# EAGLE schematic MultiSpork-v1 (EAGLE 6.5.0)

## Sheet 1 of 6
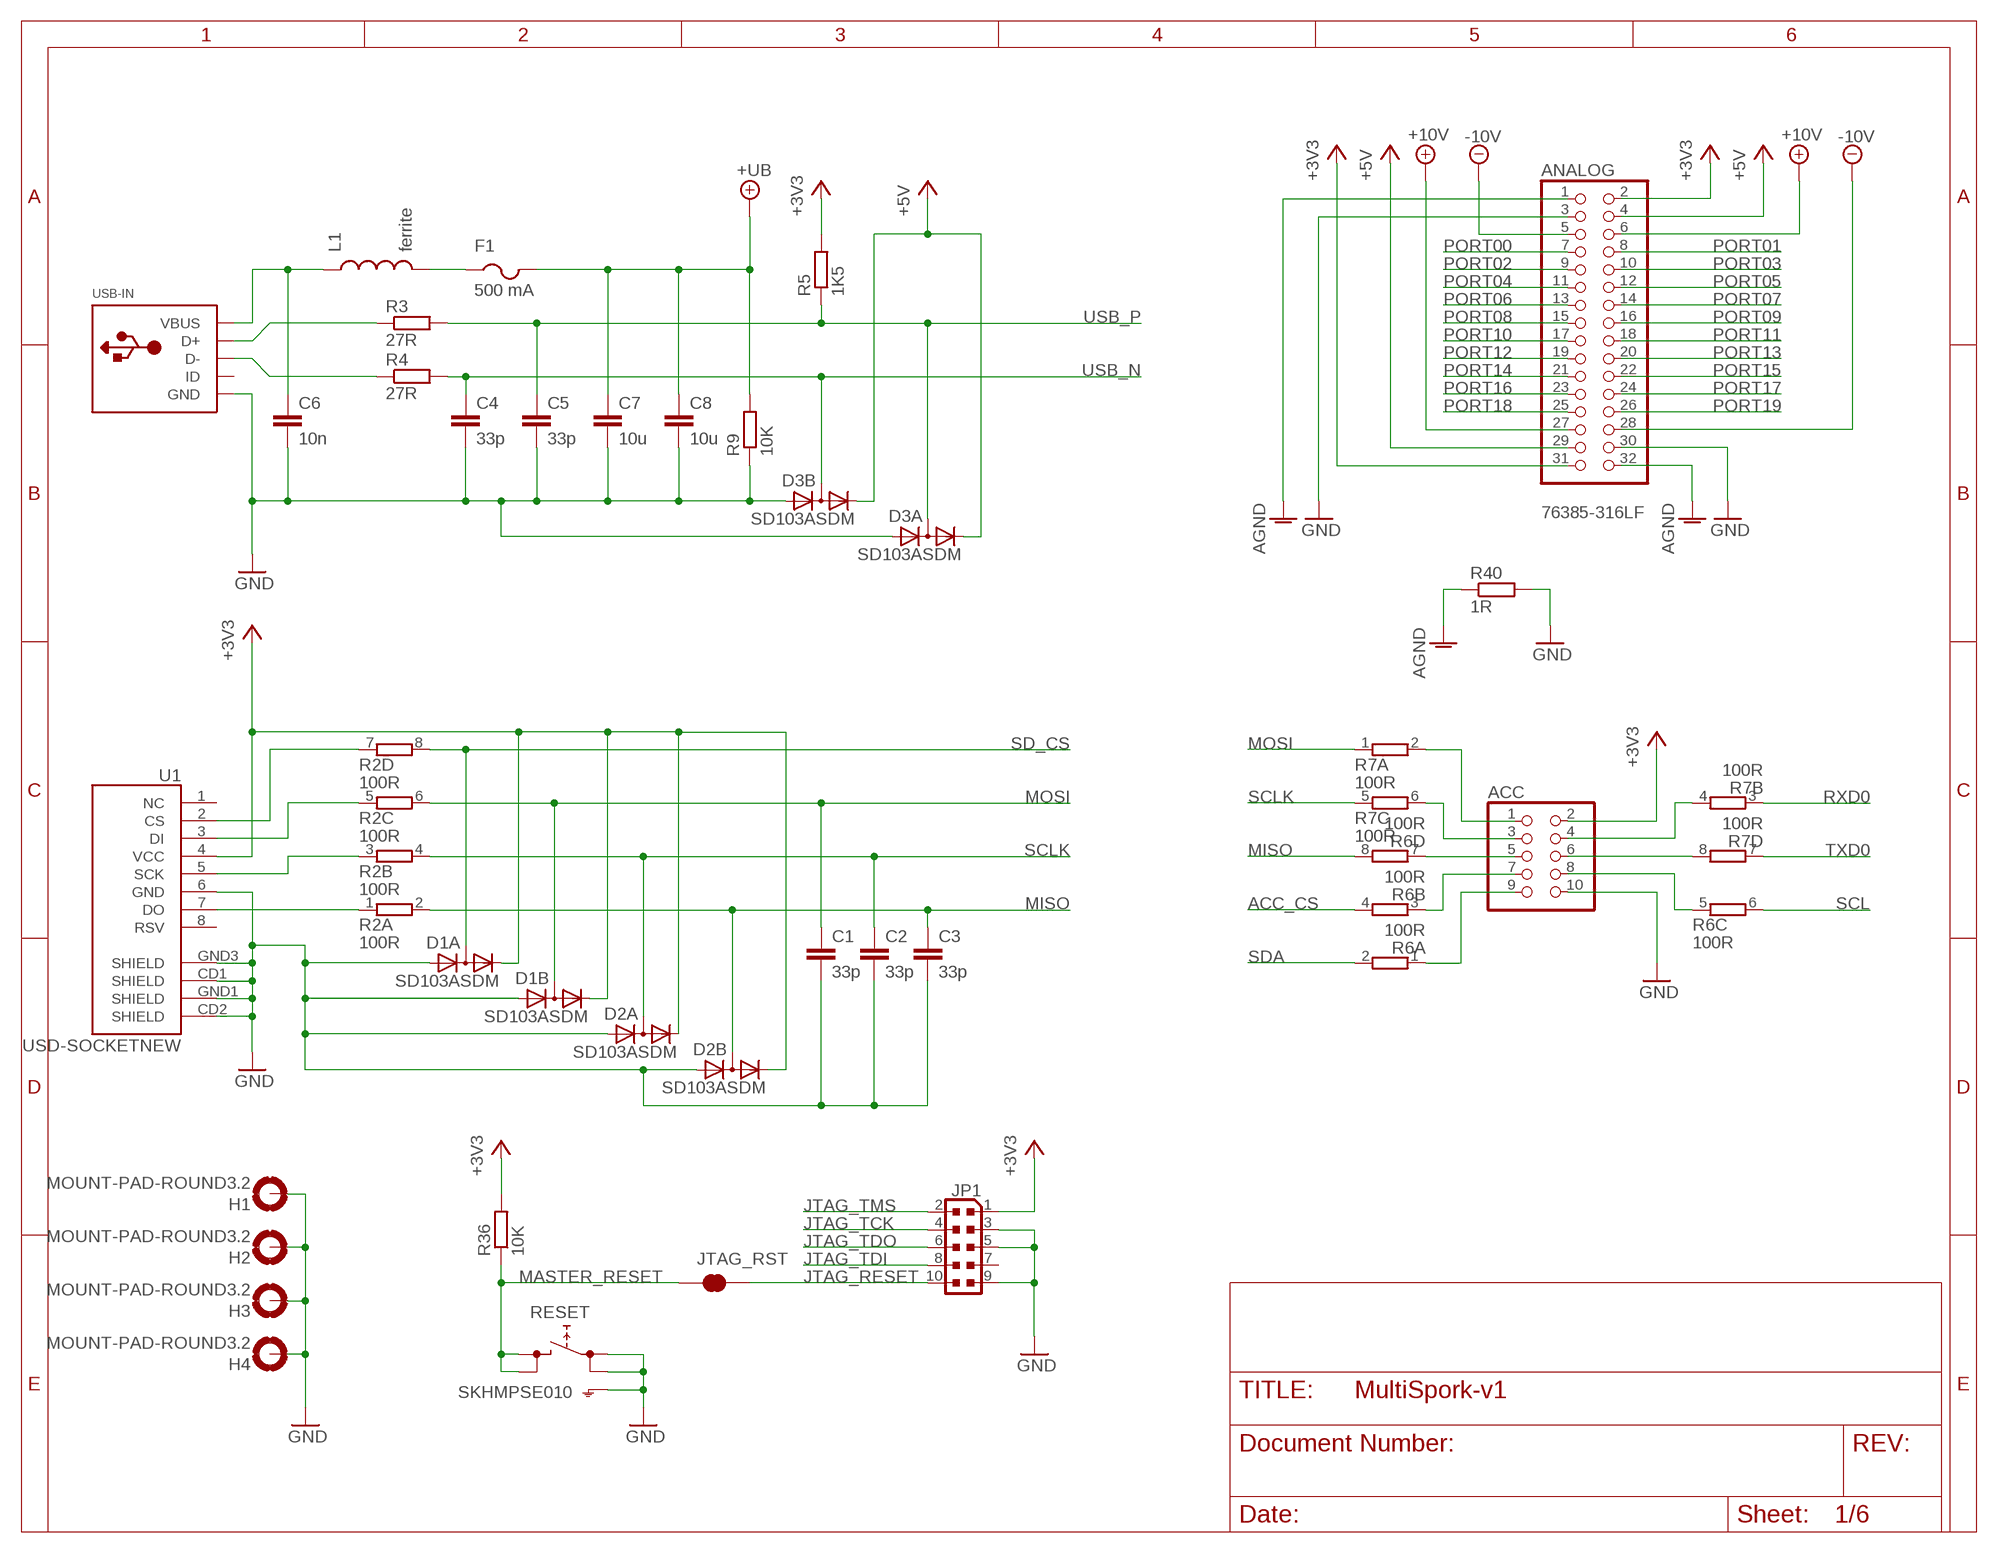
[diagram p0: schematic, sheet 1]

### Parts
ACC  PINHD-2X5_2.54  [2X05]
ANALOG  76385-316LF  [32P-SIDE-SMD]
C1  33p  C-EUC0603  [C0603]
C2  33p  C-EUC0603  [C0603]
C3  33p  C-EUC0603  [C0603]
C4  33p  C-EUC0603  [C0603]
C5  33p  C-EUC0603  [C0603]
C6  10n  C-EUC0603  [C0603]
C7  10u  C-EUC1206  [C1206]
C8  10u  C-EUC1206  [C1206]
D1  SD103ASDM  [SOT26]
D2  SD103ASDM  [SOT26]
D3  SD103ASDM  [SOT26]
F1  500 mA  PTCFUSE-1206  [R1206]
H1  MOUNT-PAD-ROUND3.2  [3,2-PAD]
H2  MOUNT-PAD-ROUND3.2  [3,2-PAD]
H3  MOUNT-PAD-ROUND3.2  [3,2-PAD]
H4  MOUNT-PAD-ROUND3.2  [3,2-PAD]
JP1  PINHEAD_PINHD-2X5PASSO127  [PINHEAD_2X05_127]
JTAG_RST  JUMPER-PAD-2-NC_BY_TRACE  [PAD-JUMPER-2-NC_BY_TRACE_YES_SILK]
L1  ferrite  INDUCTOR0805  [0805]
R2  100R  4R-NCTS742C083  [CTS742C083-RES]
R3  27R  R-EU_R0603  [R0603]
R4  27R  R-EU_R0603  [R0603]
R5  1K5  R-EU_R0603  [R0603]
R6  100R  4R-NCTS742C083  [CTS742C083-RES]
R7  100R  4R-NCTS742C083  [CTS742C083-RES]
R9  10K  R-EU_R0603  [R0603]
R36  10K  R-EU_R0603  [R0603]
R40  1R  R-EU_R1206  [R1206]
RESET  SKHMPSE010  [SKHMPXE010]
U1  USD-SOCKETNEW  [MICRO-SD-SOCKET-PP]
USB-IN  USBMINIB  [USB-MINIB]

### Nets
+3V3: ACC.2 ANALOG.2 ANALOG.31 D1.2(A:C) D1.5(B:C) D2.2(A:C) D2.5(B:C) JP1.1 R5.2 R36.2 U1.4(VCC) ; also sheet 2,3,5,6
+5V: ANALOG.4 ANALOG.29 D3.2(A:C) D3.5(B:C) ; also sheet 3,5
+10V: ANALOG.6 ANALOG.27 ; also sheet 3,4,5
+UB: C7.1 C8.1 F1.2 R9.2 ; also sheet 3
-10V: ANALOG.5 ANALOG.28 ; also sheet 3,4,5
ACC_CS: R6.4 ; also sheet 2
AGND: ANALOG.1 ANALOG.32 R40.1 ; also sheet 5
GND: ACC.10 ANALOG.3 ANALOG.30 C1.2 C2.2 C3.2 C4.2 C5.2 C6.2 C7.2 C8.2 D1.3(A:A) D1.6(B:A) D2.3(A:A) D2.6(B:A) D3.3(A:A) D3.6(B:A) H1.B3,2(MOUNT) H2.B3,2(MOUNT) H3.B3,2(MOUNT) H4.B3,2(MOUNT) JP1.3 JP1.5 JP1.9 R9.1 R40.2 RESET.1(1.1) RESET.2(1.2) RESET.5(SH) U1.6(GND) U1.CD1(SHIELD) U1.CD2(SHIELD) U1.GND1(SHIELD) U1.GND3(SHIELD) USB-IN.GND ; also sheet 2,3,5,6
JTAG_RESET: JP1.10 JTAG_RST.2
JTAG_TCK: JP1.4 ; also sheet 2
JTAG_TDI: JP1.8 ; also sheet 2
JTAG_TDO: JP1.6 ; also sheet 2
JTAG_TMS: JP1.2 ; also sheet 2
MASTER_RESET: JTAG_RST.1 R36.1 RESET.3(2.1) RESET.4(2.2) ; also sheet 2
MISO: C3.1 D2.1(B:AC) R2.2 R6.8 ; also sheet 2
MOSI: C1.1 D1.1(B:AC) R2.6 R7.1 ; also sheet 2
N$1: C6.1 L1.1 USB-IN.VBUS
N$2: R2.7 U1.2(CS)
N$4: R2.5 U1.3(DI)
N$5: R2.3 U1.5(SCK)
N$6: R2.1 U1.7(DO)
N$7: R3.1 USB-IN.D+
N$8: R4.1 USB-IN.D-
N$9: ACC.1 R7.2
N$10: ACC.3 R7.6
N$11: ACC.5 R6.7
N$12: ACC.7 R6.3
N$13: ACC.9 R6.1
N$14: ACC.6 R7.8
N$15: ACC.4 R7.4
N$16: ACC.8 R6.5
N$17: F1.1 L1.2
PORT00: ANALOG.7 ; also sheet 4
PORT01: ANALOG.8 ; also sheet 4
PORT02: ANALOG.9 ; also sheet 4
PORT03: ANALOG.10 ; also sheet 4
PORT04: ANALOG.11 ; also sheet 4
PORT05: ANALOG.12 ; also sheet 4
PORT06: ANALOG.13 ; also sheet 4
PORT07: ANALOG.14 ; also sheet 4
PORT08: ANALOG.15 ; also sheet 4
PORT09: ANALOG.16 ; also sheet 4
PORT10: ANALOG.17 ; also sheet 4
PORT11: ANALOG.18 ; also sheet 4
PORT12: ANALOG.19 ; also sheet 4
PORT13: ANALOG.20 ; also sheet 4
PORT14: ANALOG.21 ; also sheet 4
PORT15: ANALOG.22 ; also sheet 4
PORT16: ANALOG.23 ; also sheet 4
PORT17: ANALOG.24 ; also sheet 4
PORT18: ANALOG.25 ; also sheet 4
PORT19: ANALOG.26 ; also sheet 4
RXD0: R7.3 ; also sheet 2
SCL: R6.6 ; also sheet 2
SCLK: C2.1 D2.4(A:AC) R2.4 R7.5 ; also sheet 2
SD_CS: D1.4(A:AC) R2.8 ; also sheet 2
SDA: R6.2 ; also sheet 2
TXD0: R7.7 ; also sheet 2
USB_N: C4.1 D3.1(B:AC) R4.2 ; also sheet 2
USB_P: C5.1 D3.4(A:AC) R3.2 R5.1 ; also sheet 2
Unconnected: JP1.7 U1.1(NC) U1.8(RSV) USB-IN.ID

## Sheet 2 of 6
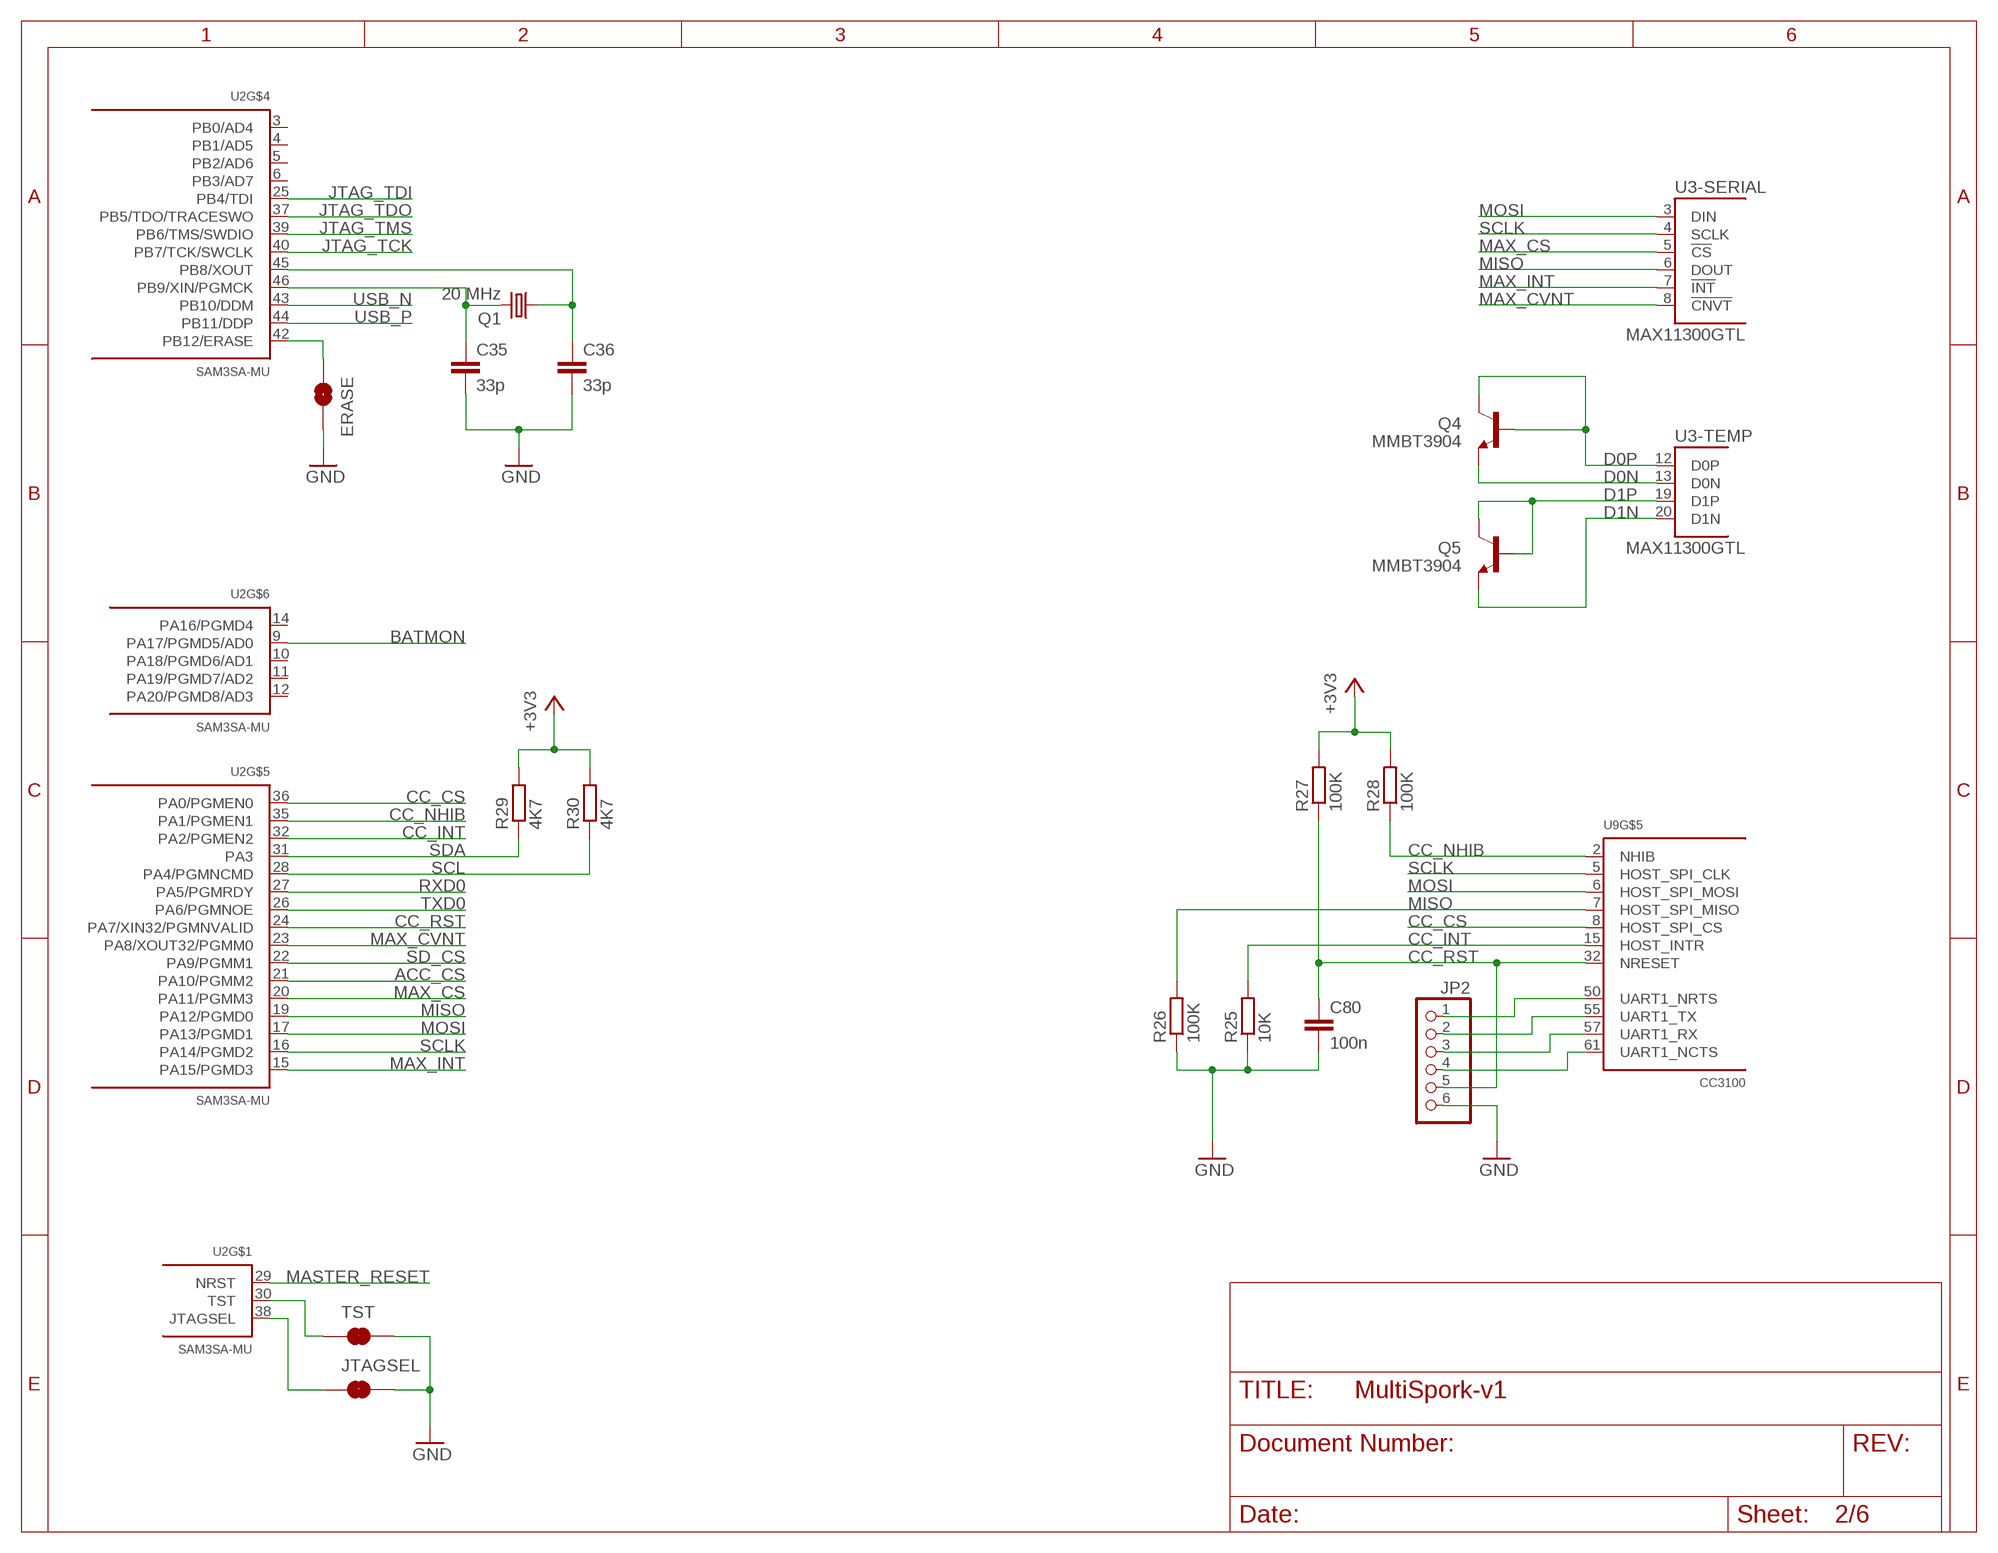
[diagram p1: schematic, sheet 2]

### Parts
C35  33p  C-EUC0603  [C0603]
C36  33p  C-EUC0603  [C0603]
C80  100n  C-EUC0603  [C0603]
ERASE  JUMPER-PAD-2-NOYES_SILK  [PAD-JUMPER-2-NO_YES_SILK]
JP2  PINHD-1X6  [1X06]
JTAGSEL  JUMPER-PAD-2-NC_BY_TRACE  [PAD-JUMPER-2-NC_BY_TRACE_YES_SILK]
Q1  20 MHz  CRYSTALCSM-3X  [CSM-3X]
Q4  MMBT3904  TRANSISTOR_NPNMMBT5088  [SOT23]
Q5  MMBT3904  TRANSISTOR_NPNMMBT5088  [SOT23]
R25  10K  R-EU_R0603  [R0603]
R26  100K  R-EU_R0603  [R0603]
R27  100K  R-EU_R0603  [R0603]
R28  100K  R-EU_R0603  [R0603]
R29  4K7  R-EU_R0603  [R0603]
R30  4K7  R-EU_R0603  [R0603]
TST  JUMPER-PAD-2-NC_BY_TRACE  [PAD-JUMPER-2-NC_BY_TRACE_YES_SILK]
U2  SAM3SA-MU  [QFN48]
U3  MAX11300GTL  [TQFN40]
U9  CC3100  [QFN64]

### Nets
+3V3: R27.2 R28.2 R29.2 R30.2 ; also sheet 1,3,5,6
ACC_CS: U2.21(PA10/PGMM2) ; also sheet 1
BATMON: U2.9(PA17/PGMD5/AD0) ; also sheet 3
CC_CS: U2.36(PA0/PGMEN0) U9.8(HOST_SPI_CS)
CC_INT: R25.2 U2.32(PA2/PGMEN2) U9.15(HOST_INTR)
CC_NHIB: R28.1 U2.35(PA1/PGMEN1) U9.2(NHIB)
CC_RST: C80.1 JP2.5 R27.1 U2.24(PA7/XIN32/PGMNVALID) U9.32(NRESET)
D0N: Q4.2(E) U3.13(-TEMP:D0N)
D0P: Q4.1(B) Q4.3(C) U3.12(-TEMP:D0P)
D1N: Q5.2(E) U3.20(-TEMP:D1N)
D1P: Q5.1(B) Q5.3(C) U3.19(-TEMP:D1P)
GND: C35.2 C36.2 C80.2 ERASE.2 JP2.6 JTAGSEL.2 R25.1 R26.1 TST.2 ; also sheet 1,3,5,6
JTAG_TCK: U2.40(PB7/TCK/SWCLK) ; also sheet 1
JTAG_TDI: U2.25(PB4/TDI) ; also sheet 1
JTAG_TDO: U2.37(PB5/TDO/TRACESWO) ; also sheet 1
JTAG_TMS: U2.39(PB6/TMS/SWDIO) ; also sheet 1
MASTER_RESET: U2.29(NRST) ; also sheet 1
MAX_CS: U2.20(PA11/PGMM3) U3.5(-SERIAL:!CS!)
MAX_CVNT: U2.23(PA8/XOUT32/PGMM0) U3.8(-SERIAL:!CNVT!)
MAX_INT: U2.15(PA15/PGMD3) U3.7(-SERIAL:!INT!)
MISO: R26.2 U2.19(PA12/PGMD0) U3.6(-SERIAL:DOUT) U9.7(HOST_SPI_MISO) ; also sheet 1
MOSI: U2.17(PA13/PGMD1) U3.3(-SERIAL:DIN) U9.6(HOST_SPI_MOSI) ; also sheet 1
N$3: C35.1 Q1.2 U2.46(PB9/XIN/PGMCK)
N$27: C36.1 Q1.1 U2.45(PB8/XOUT)
N$29: TST.1 U2.30(TST)
N$30: JTAGSEL.1 U2.38(JTAGSEL)
N$31: ERASE.1 U2.42(PB12/ERASE)
N$106: JP2.1 U9.50(UART1_NRTS)
N$107: JP2.2 U9.55(UART1_TX)
N$108: JP2.3 U9.57(UART1_RX)
N$109: JP2.4 U9.61(UART1_NCTS)
RXD0: U2.27(PA5/PGMRDY) ; also sheet 1
SCL: R30.1 U2.28(PA4/PGMNCMD) ; also sheet 1
SCLK: U2.16(PA14/PGMD2) U3.4(-SERIAL:SCLK) U9.5(HOST_SPI_CLK) ; also sheet 1
SD_CS: U2.22(PA9/PGMM1) ; also sheet 1
SDA: R29.1 U2.31(PA3) ; also sheet 1
TXD0: U2.26(PA6/PGMNOE) ; also sheet 1
USB_N: U2.43(PB10/DDM) ; also sheet 1
USB_P: U2.44(PB11/DDP) ; also sheet 1
Unconnected: U2.3(PB0/AD4) U2.4(PB1/AD5) U2.5(PB2/AD6) U2.6(PB3/AD7) U2.10(PA18/PGMD6/AD1) U2.11(PA19/PGMD7/AD2) U2.12(PA20/PGMD8/AD3) U2.14(PA16/PGMD4)

## Sheet 3 of 6
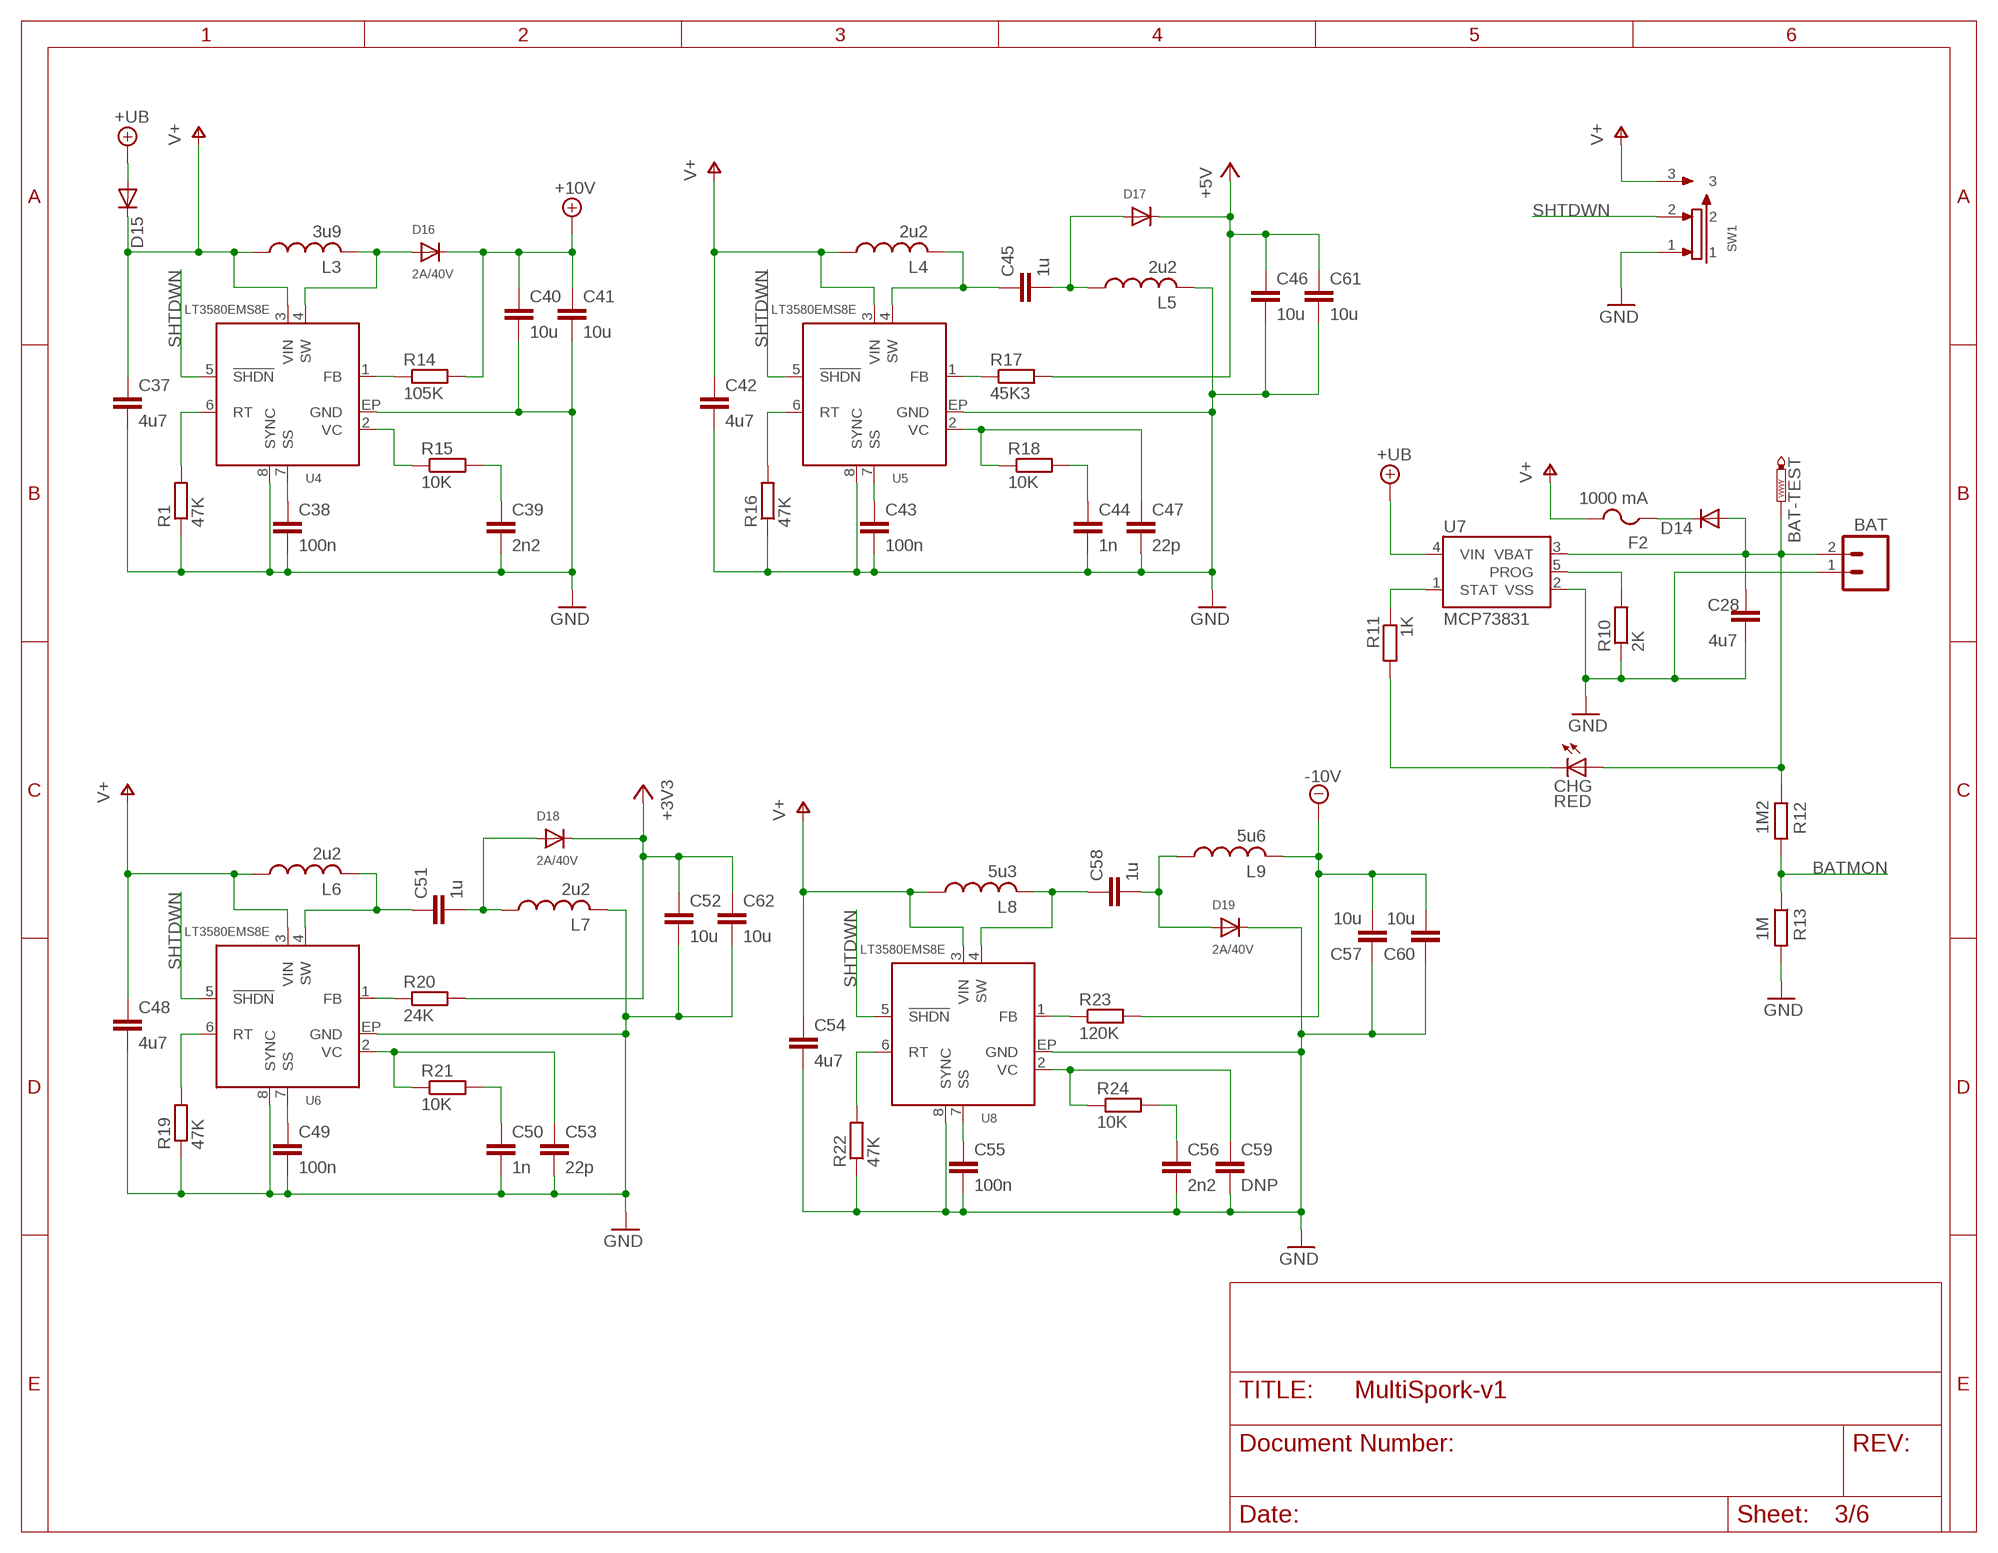
[diagram p2: schematic, sheet 3]

### Parts
BAT  M02-JST-2MM-SMT  [S2B-PH]
BAT-TEST  PTR1TP13SQ  [TP13SQ]
C28  4u7  C-EUC1206  [C1206]
C37  4u7  C-EUC1210  [C1210]
C38  100n  C-EUC0603  [C0603]
C39  2n2  C-EUC0603  [C0603]
C40  10u  C-EUC1210  [C1210]
C41  10u  C-EUC1210  [C1210]
C42  4u7  C-EUC1210  [C1210]
C43  100n  C-EUC0603  [C0603]
C44  1n  C-EUC0603  [C0603]
C45  1u  C-EUC1210  [C1210]
C46  10u  C-EUC1210  [C1210]
C47  22p  C-EUC0603  [C0603]
C48  4u7  C-EUC1210  [C1210]
C49  100n  C-EUC0603  [C0603]
C50  1n  C-EUC0603  [C0603]
C51  1u  C-EUC1210  [C1210]
C52  10u  C-EUC1210  [C1210]
C53  22p  C-EUC0603  [C0603]
C54  4u7  C-EUC1210  [C1210]
C55  100n  C-EUC0603  [C0603]
C56  2n2  C-EUC0603  [C0603]
C57  10u  C-EUC1210  [C1210]
C58  1u  C-EUC1210  [C1210]
C59  DNP  C-EUC0603  [C0603]
C60  10u  C-EUC1210  [C1210]
C61  10u  C-EUC1210  [C1210]
C62  10u  C-EUC1210  [C1210]
CHG  RED  LEDCHIP-LED0603  [CHIP-LED0603]
D14  DIODE-SMB  [SMB]
D15  DIODE-SMB  [SMB]
D16  2A/40V  DIODESMA  [SMADIODE]
D17  DIODESOD-123  [SOD-123]
D18  2A/40V  DIODESMA  [SMADIODE]
D19  2A/40V  DIODESMA  [SMADIODE]
F2  1000 mA  PTCFUSE-1206  [R1206]
L3  3u9  L-US2323  [L2323]
L4  2u2  L-US1008  [L1008]
L5  2u2  L-US1008  [L1008]
L6  2u2  L-US1008  [L1008]
L7  2u2  L-US1008  [L1008]
L8  5u3  L-US2323  [L2323]
L9  5u6  L-US1008  [L1008]
R1  47K  R-EU_R0603  [R0603]
R10  2K  R-EU_R0603  [R0603]
R11  1K  R-EU_R0603  [R0603]
R12  1M2  R-EU_R0603  [R0603]
R13  1M  R-EU_R0603  [R0603]
R14  105K  R-EU_R0603  [R0603]
R15  10K  R-EU_R0603  [R0603]
R16  47K  R-EU_R0603  [R0603]
R17  45K3  R-EU_R0603  [R0603]
R18  10K  R-EU_R0603  [R0603]
R19  47K  R-EU_R0603  [R0603]
R20  24K  R-EU_R0603  [R0603]
R21  10K  R-EU_R0603  [R0603]
R22  47K  R-EU_R0603  [R0603]
R23  120K  R-EU_R0603  [R0603]
R24  10K  R-EU_R0603  [R0603]
SW1  JS102011SAQN  [JS102011SAQN]
U4  LT3580EMS8E  [MSOP8]
U5  LT3580EMS8E  [MSOP8]
U6  LT3580EMS8E  [MSOP8]
U7  MCP73831  [SOT23-5]
U8  LT3580EMS8E  [MSOP8]

### Nets
+3V3: C52.1 C62.1 D18.C R20.2 ; also sheet 1,2,5,6
+5V: C46.1 C61.1 D17.C R17.2 ; also sheet 1,5
+10V: C40.1 C41.1 D16.C R14.2 ; also sheet 1,4,5
+UB: D15.A U7.4(VIN) ; also sheet 1
-10V: C57.2 C60.2 L9.2 R23.2 ; also sheet 1,4,5
BATMON: R12.2 R13.1 ; also sheet 2
GND: BAT.1 C28.2 C37.2 C38.2 C39.2 C40.2 C41.2 C42.2 C43.2 C44.2 C46.2 C47.2 C48.2 C49.2 C50.2 C52.2 C53.2 C54.2 C55.2 C56.2 C57.1 C59.2 C60.1 C61.2 C62.2 D19.C L5.2 L7.2 R1.1 R10.1 R13.2 R16.1 R19.1 R22.1 SW1.1 U4.8(SYNC) U4.EP(GND) U5.8(SYNC) U5.EP(GND) U6.8(SYNC) U6.EP(GND) U7.2(VSS) U8.8(SYNC) U8.EP(GND) ; also sheet 1,2,5,6
N$18: C38.1 U4.7(SS)
N$20: R1.2 U4.6(RT)
N$21: R14.1 U4.1(FB)
N$22: R15.1 U4.2(VC)
N$23: C39.1 R15.2
N$24: C43.1 U5.7(SS)
N$25: D16.A L3.4 U4.4(SW)
N$26: R16.2 U5.6(RT)
N$28: R17.1 U5.1(FB)
N$48: R10.2 U7.5(PROG)
N$55: R11.1 U7.1(STAT)
N$57: CHG.C R11.2
N$58: D14.C F2.1
N$60: C47.1 R18.1 U5.2(VC)
N$61: C44.1 R18.2
N$63: C45.1 L4.2 U5.4(SW)
N$64: C45.2 D17.A L5.1
N$65: C55.1 U8.7(SS)
N$66: R22.2 U8.6(RT)
N$67: R23.1 U8.1(FB)
N$68: C49.1 U6.7(SS)
N$69: R19.2 U6.6(RT)
N$70: R20.1 U6.1(FB)
N$71: C53.1 R21.1 U6.2(VC)
N$72: C50.1 R21.2
N$73: C51.1 L6.2 U6.4(SW)
N$74: C51.2 D18.A L7.1
N$75: C59.1 R24.1 U8.2(VC)
N$76: C56.1 R24.2
N$77: C58.1 L8.4 U8.4(SW)
N$78: C58.2 D19.A L9.1
SHTDWN: SW1.2 U4.5(!SHDN!) U5.5(!SHDN!) U6.5(!SHDN!) U8.5(!SHDN!)
V+: C37.1 C42.1 C48.1 C54.1 D15.C F2.2 L3.3 L4.1 L6.1 L8.3 SW1.3 U4.3(VIN) U5.3(VIN) U6.3(VIN) U8.3(VIN)
VBAT1: BAT-TEST.TP BAT.2 C28.1 CHG.A D14.A R12.1 U7.3(VBAT)

## Sheet 4 of 6
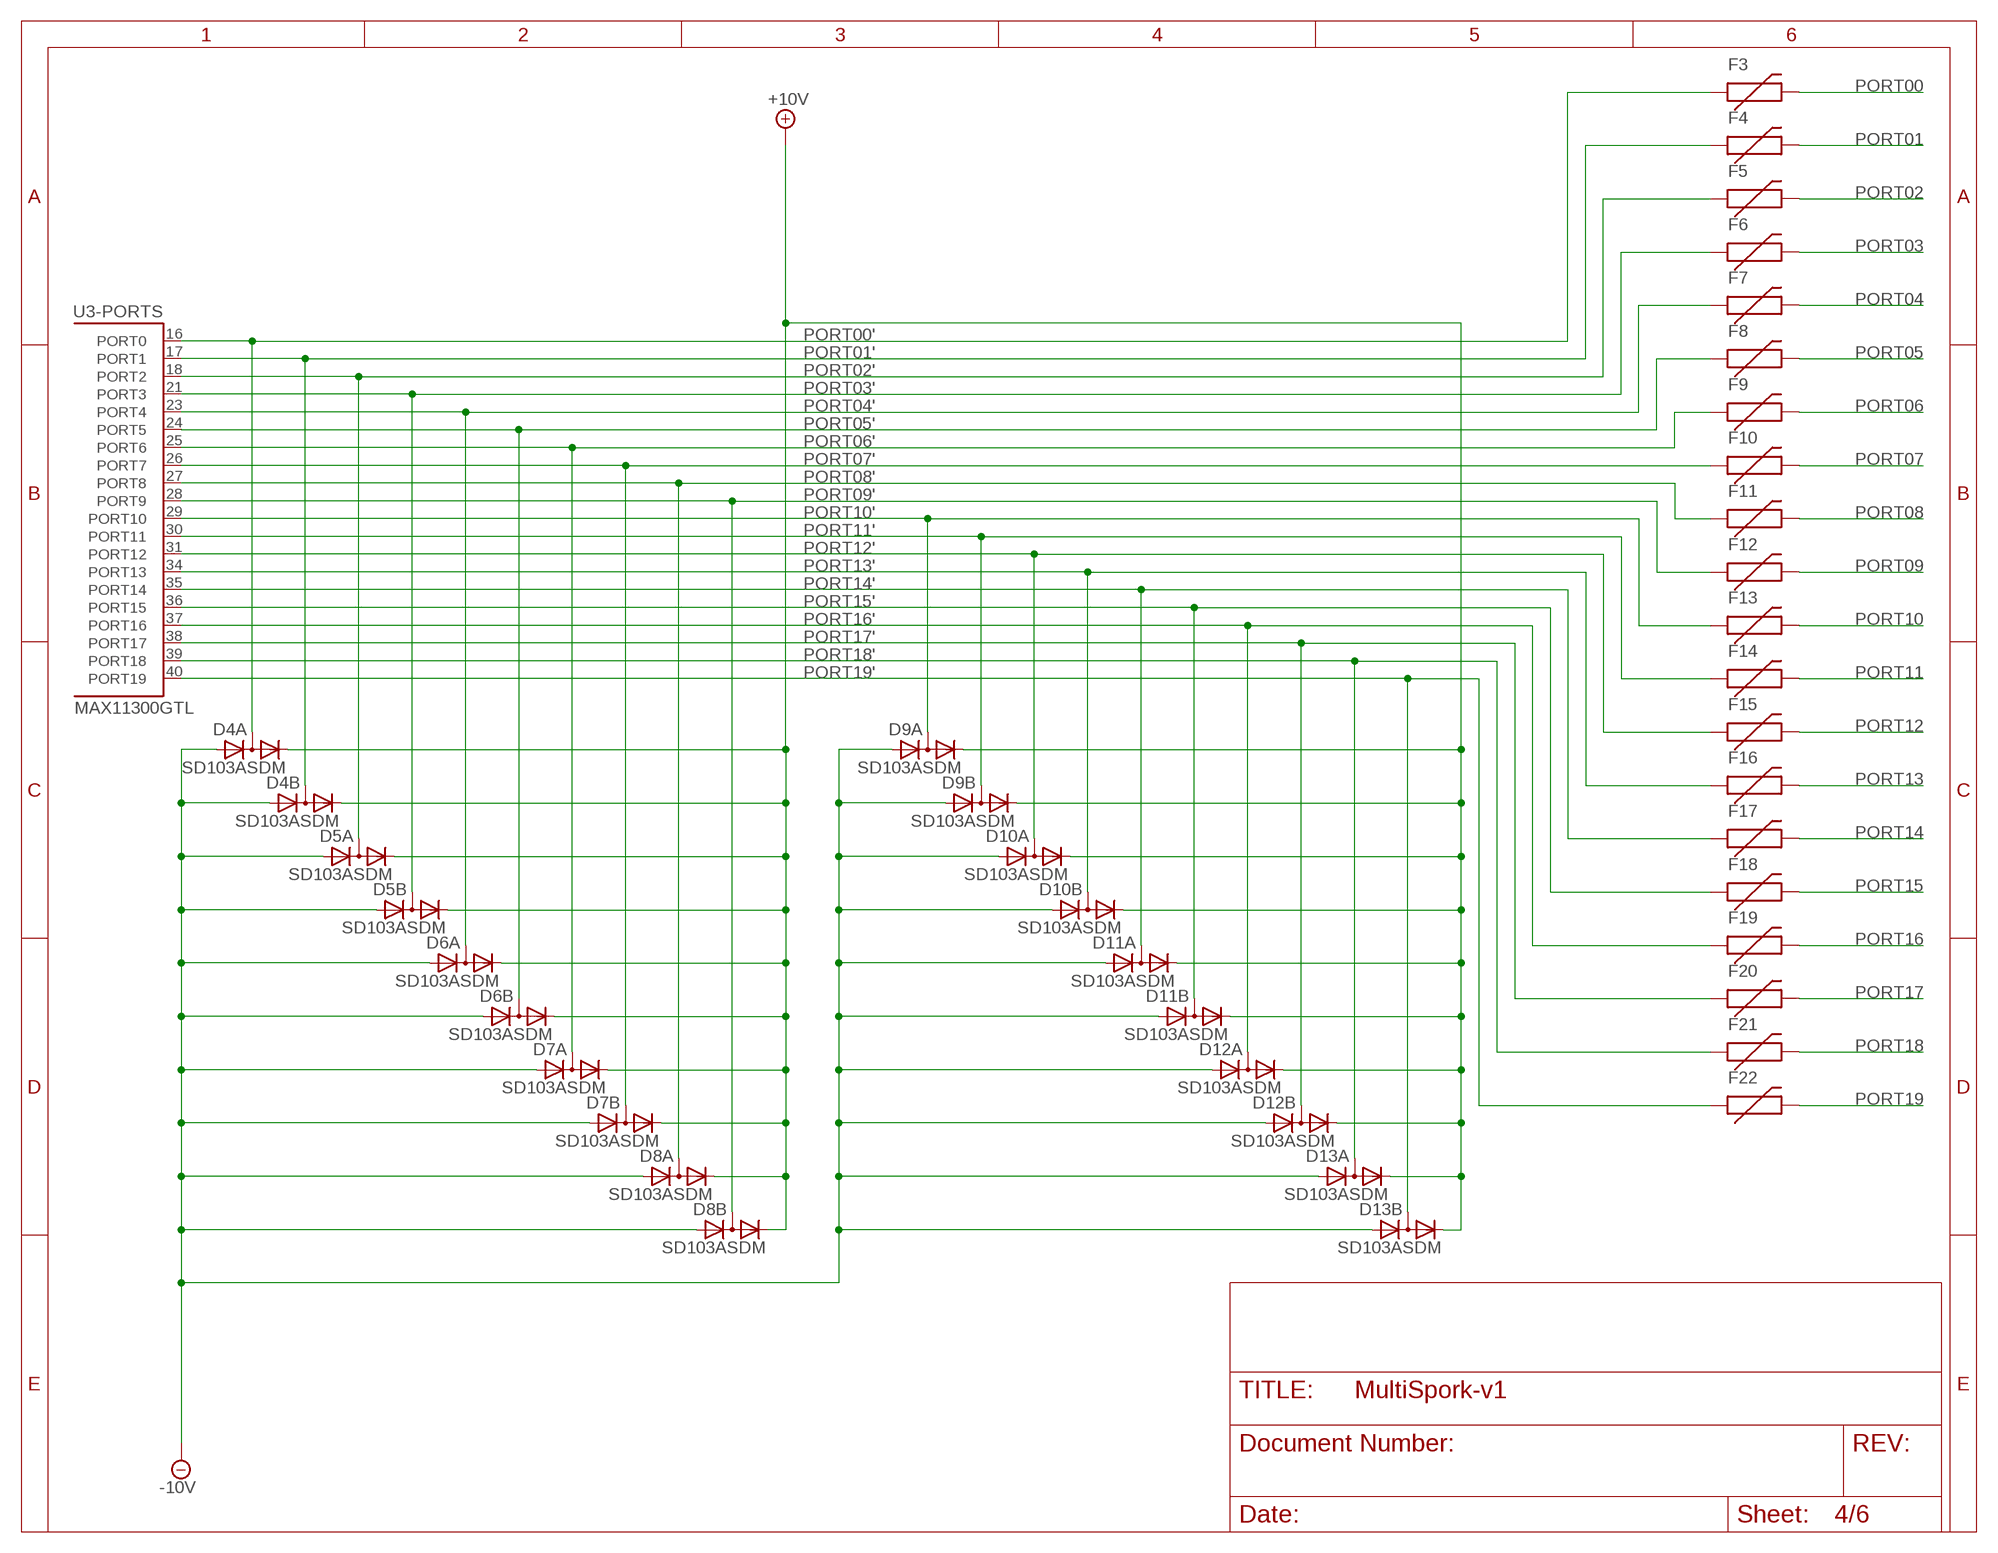
[diagram p3: schematic, sheet 4]

### Parts
D4  SD103ASDM  [SOT26]
D5  SD103ASDM  [SOT26]
D6  SD103ASDM  [SOT26]
D7  SD103ASDM  [SOT26]
D8  SD103ASDM  [SOT26]
D9  SD103ASDM  [SOT26]
D10  SD103ASDM  [SOT26]
D11  SD103ASDM  [SOT26]
D12  SD103ASDM  [SOT26]
D13  SD103ASDM  [SOT26]
F3  PTC0603  [0603]
F4  PTC0603  [0603]
F5  PTC0603  [0603]
F6  PTC0603  [0603]
F7  PTC0603  [0603]
F8  PTC0603  [0603]
F9  PTC0603  [0603]
F10  PTC0603  [0603]
F11  PTC0603  [0603]
F12  PTC0603  [0603]
F13  PTC0603  [0603]
F14  PTC0603  [0603]
F15  PTC0603  [0603]
F16  PTC0603  [0603]
F17  PTC0603  [0603]
F18  PTC0603  [0603]
F19  PTC0603  [0603]
F20  PTC0603  [0603]
F21  PTC0603  [0603]
F22  PTC0603  [0603]

### Nets
+10V: D4.2(A:C) D4.5(B:C) D5.2(A:C) D5.5(B:C) D6.2(A:C) D6.5(B:C) D7.2(A:C) D7.5(B:C) D8.2(A:C) D8.5(B:C) D9.2(A:C) D9.5(B:C) D10.2(A:C) D10.5(B:C) D11.2(A:C) D11.5(B:C) D12.2(A:C) D12.5(B:C) D13.2(A:C) D13.5(B:C) ; also sheet 1,3,5
-10V: D4.3(A:A) D4.6(B:A) D5.3(A:A) D5.6(B:A) D6.3(A:A) D6.6(B:A) D7.3(A:A) D7.6(B:A) D8.3(A:A) D8.6(B:A) D9.3(A:A) D9.6(B:A) D10.3(A:A) D10.6(B:A) D11.3(A:A) D11.6(B:A) D12.3(A:A) D12.6(B:A) D13.3(A:A) D13.6(B:A) ; also sheet 1,3,5
PORT00: F3.2 ; also sheet 1
PORT00': D4.4(A:AC) F3.1 U3.16(-PORTS:PORT0)
PORT01: F4.2 ; also sheet 1
PORT01': D4.1(B:AC) F4.1 U3.17(-PORTS:PORT1)
PORT02: F5.2 ; also sheet 1
PORT02': D5.4(A:AC) F5.1 U3.18(-PORTS:PORT2)
PORT03: F6.2 ; also sheet 1
PORT03': D5.1(B:AC) F6.1 U3.21(-PORTS:PORT3)
PORT04: F7.2 ; also sheet 1
PORT04': D6.4(A:AC) F7.1 U3.23(-PORTS:PORT4)
PORT05: F8.2 ; also sheet 1
PORT05': D6.1(B:AC) F8.1 U3.24(-PORTS:PORT5)
PORT06: F9.2 ; also sheet 1
PORT06': D7.4(A:AC) F9.1 U3.25(-PORTS:PORT6)
PORT07: F10.2 ; also sheet 1
PORT07': D7.1(B:AC) F10.1 U3.26(-PORTS:PORT7)
PORT08: F11.2 ; also sheet 1
PORT08': D8.4(A:AC) F11.1 U3.27(-PORTS:PORT8)
PORT09: F12.2 ; also sheet 1
PORT09': D8.1(B:AC) F12.1 U3.28(-PORTS:PORT9)
PORT10: F13.2 ; also sheet 1
PORT10': D9.4(A:AC) F13.1 U3.29(-PORTS:PORT10)
PORT11: F14.2 ; also sheet 1
PORT11': D9.1(B:AC) F14.1 U3.30(-PORTS:PORT11)
PORT12: F15.2 ; also sheet 1
PORT12': D10.4(A:AC) F15.1 U3.31(-PORTS:PORT12)
PORT13: F16.2 ; also sheet 1
PORT13': D10.1(B:AC) F16.1 U3.34(-PORTS:PORT13)
PORT14: F17.2 ; also sheet 1
PORT14': D11.4(A:AC) F17.1 U3.35(-PORTS:PORT14)
PORT15: F18.2 ; also sheet 1
PORT15': D11.1(B:AC) F18.1 U3.36(-PORTS:PORT15)
PORT16: F19.2 ; also sheet 1
PORT16': D12.4(A:AC) F19.1 U3.37(-PORTS:PORT16)
PORT17: F20.2 ; also sheet 1
PORT17': D12.1(B:AC) F20.1 U3.38(-PORTS:PORT17)
PORT18: F21.2 ; also sheet 1
PORT18': D13.4(A:AC) F21.1 U3.39(-PORTS:PORT18)
PORT19: F22.2 ; also sheet 1
PORT19': D13.1(B:AC) F22.1 U3.40(-PORTS:PORT19)

## Sheet 5 of 6
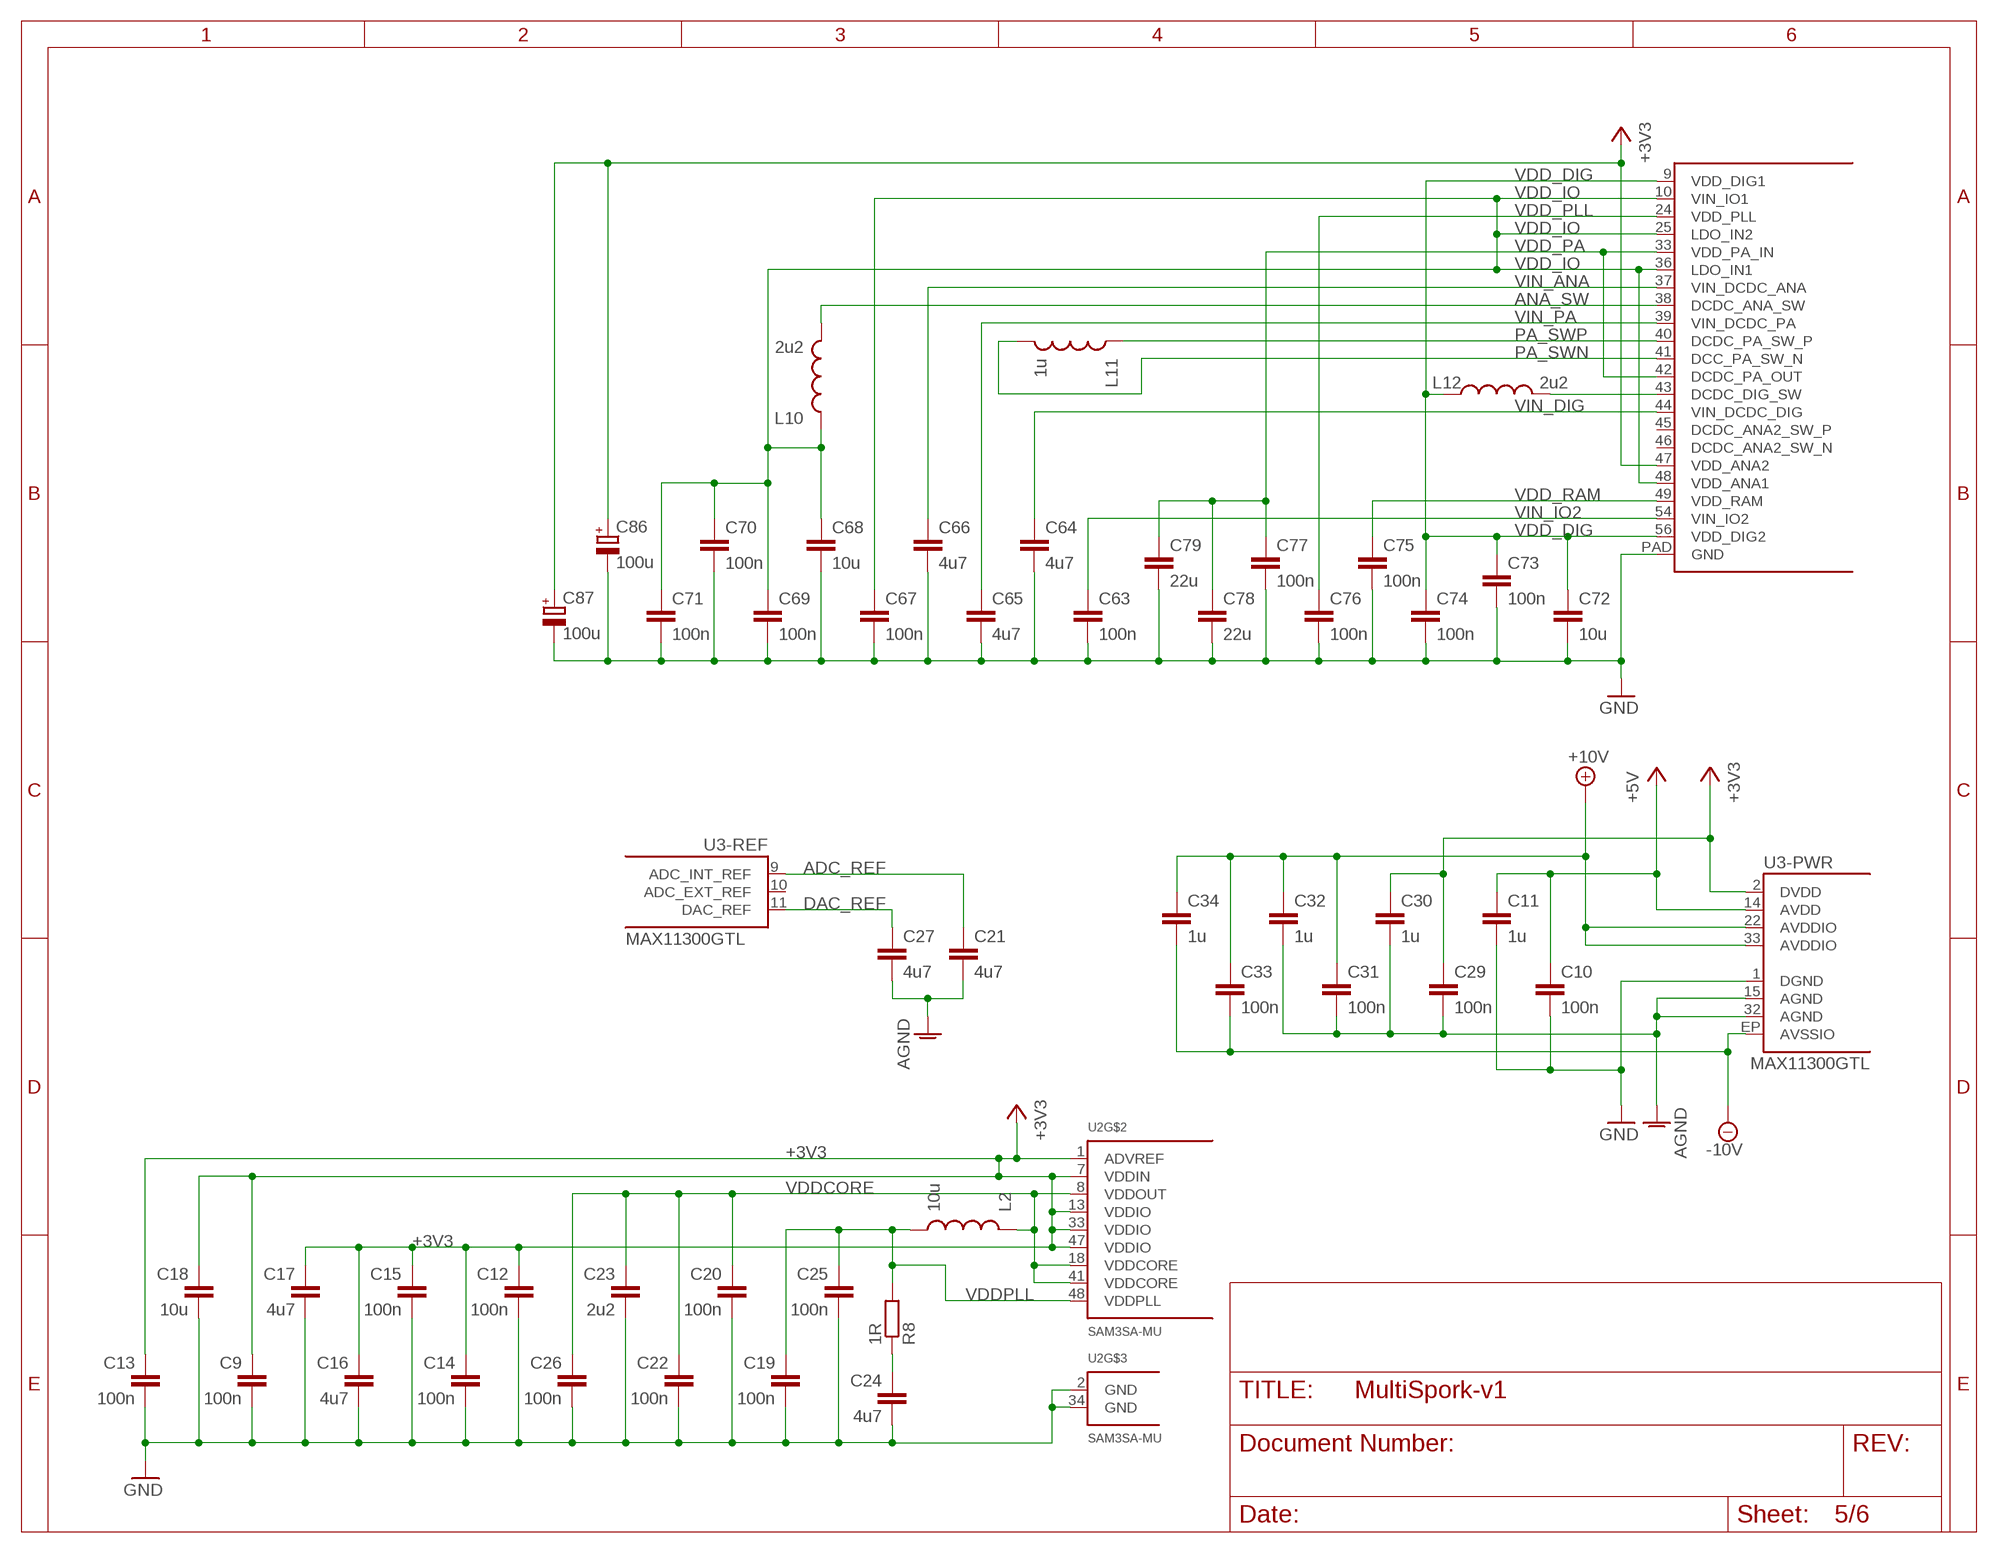
[diagram p4: schematic, sheet 5]

### Parts
C9  100n  C-EUC0603  [C0603]
C10  100n  C-EUC0603  [C0603]
C11  1u  C-EUC0603  [C0603]
C12  100n  C-EUC0603  [C0603]
C13  100n  C-EUC0603  [C0603]
C14  100n  C-EUC0603  [C0603]
C15  100n  C-EUC0603  [C0603]
C16  4u7  C-EUC0603  [C0603]
C17  4u7  C-EUC0603  [C0603]
C18  10u  C-EUC0603  [C0603]
C19  100n  C-EUC0603  [C0603]
C20  100n  C-EUC0603  [C0603]
C21  4u7  C-EUC0603  [C0603]
C22  100n  C-EUC0603  [C0603]
C23  2u2  C-EUC0603  [C0603]
C24  4u7  C-EUC0603  [C0603]
C25  100n  C-EUC0603  [C0603]
C26  100n  C-EUC0603  [C0603]
C27  4u7  C-EUC0603  [C0603]
C29  100n  C-EUC0603  [C0603]
C30  1u  C-EUC0603  [C0603]
C31  100n  C-EUC0603  [C0603]
C32  1u  C-EUC0603  [C0603]
C33  100n  C-EUC0603  [C0603]
C34  1u  C-EUC0603  [C0603]
C63  100n  C-EUC0603  [C0603]
C64  4u7  C-EUC0603  [C0603]
C65  4u7  C-EUC0603  [C0603]
C66  4u7  C-EUC0603  [C0603]
C67  100n  C-EUC0603  [C0603]
C68  10u  C-EUC0603  [C0603]
C69  100n  C-EUC0603  [C0603]
C70  100n  C-EUC0603  [C0603]
C71  100n  C-EUC0603  [C0603]
C72  10u  C-EUC0603  [C0603]
C73  100n  C-EUC0603  [C0603]
C74  100n  C-EUC0603  [C0603]
C75  100n  C-EUC0603  [C0603]
C76  100n  C-EUC0603  [C0603]
C77  100n  C-EUC0603  [C0603]
C78  22u  C-EUC1206  [C1206]
C79  22u  C-EUC1206  [C1206]
C86  100u  CPOL-EUCT6032  [CT6032]
C87  100u  CPOL-EUCT6032  [CT6032]
L2  10u  INDUCTOR1206H*  [INDUCTOR-1206]
L10  2u2  INDUCTOR1206H*  [INDUCTOR-1206]
L11  1u  INDUCTOR1206H*  [INDUCTOR-1206]
L12  2u2  INDUCTOR1206H*  [INDUCTOR-1206]
R8  1R  R-EU_R0603  [R0603]

### Nets
+3V3: C9.1 C12.1 C13.1 C14.1 C15.1 C16.1 C17.1 C18.1 C29.1 C30.1 C86.+ C87.+ U2.1(ADVREF) U2.7(VDDIN) U2.13(VDDIO) U2.33(VDDIO) U2.47(VDDIO) U3.2(-PWR:DVDD) U9.47(VDD_ANA2) ; also sheet 1,2,3,6
+5V: C10.1 C11.1 U3.14(-PWR:AVDD) ; also sheet 1,3
+10V: C31.1 C32.1 C33.1 C34.1 U3.22(-PWR:AVDDIO) U3.33(-PWR:AVDDIO) ; also sheet 1,3,4
-10V: C33.2 C34.2 U3.EP(-PWR:AVSSIO) ; also sheet 1,3,4
ADC_REF: C21.1 U3.9(-REF:ADC_INT_REF)
AGND: C21.2 C27.2 C29.2 C30.2 C31.2 C32.2 U3.15(-PWR:AGND) U3.32(-PWR:AGND) ; also sheet 1
ANA_SW: L10.P$2 U9.38(DCDC_ANA_SW)
DAC_REF: C27.1 U3.11(-REF:DAC_REF)
GND: C9.2 C10.2 C11.2 C12.2 C13.2 C14.2 C15.2 C16.2 C17.2 C18.2 C19.2 C20.2 C22.2 C23.2 C24.2 C25.2 C26.2 C63.2 C64.2 C65.2 C66.2 C67.2 C68.2 C69.2 C70.2 C71.2 C72.2 C73.2 C74.2 C75.2 C76.2 C77.2 C78.2 C79.2 C86.- C87.- U2.2(GND) U2.34(GND) U3.1(-PWR:DGND) U9.PAD(GND) ; also sheet 1,2,3,6
N$89: L12.P$2 U9.43(DCDC_DIG_SW)
PA_SWN: L11.P$2 U9.41(DCC_PA_SW_N)
PA_SWP: L11.P$1 U9.40(DCDC_PA_SW_P)
PLL-GND: C24.1 R8.1
VDD_DIG: C72.1 C73.1 C74.1 L12.P$1 U9.9(VDD_DIG1) U9.56(VDD_DIG2)
VDD_IO: C67.1 C68.1 C69.1 C70.1 C71.1 L10.P$1 U9.10(VIN_IO1) U9.25(LDO_IN2) U9.36(LDO_IN1) U9.48(VDD_ANA1)
VDD_PA: C77.1 C78.1 C79.1 U9.33(VDD_PA_IN) U9.42(DCDC_PA_OUT)
VDD_PLL: C76.1 U9.24(VDD_PLL)
VDD_RAM: C75.1 U9.49(VDD_RAM)
VDDCORE: C20.1 C22.1 C23.1 C26.1 L2.P$1 U2.8(VDDOUT) U2.18(VDDCORE) U2.41(VDDCORE)
VDDPLL: C19.1 C25.1 L2.P$2 R8.2 U2.48(VDDPLL)
VIN_ANA: C66.1 U9.37(VIN_DCDC_ANA)
VIN_DIG: C64.1 U9.44(VIN_DCDC_DIG)
VIN_IO2: C63.1 U9.54(VIN_IO2)
VIN_PA: C65.1 U9.39(VIN_DCDC_PA)
Unconnected: U3.10(-REF:ADC_EXT_REF)

## Sheet 6 of 6
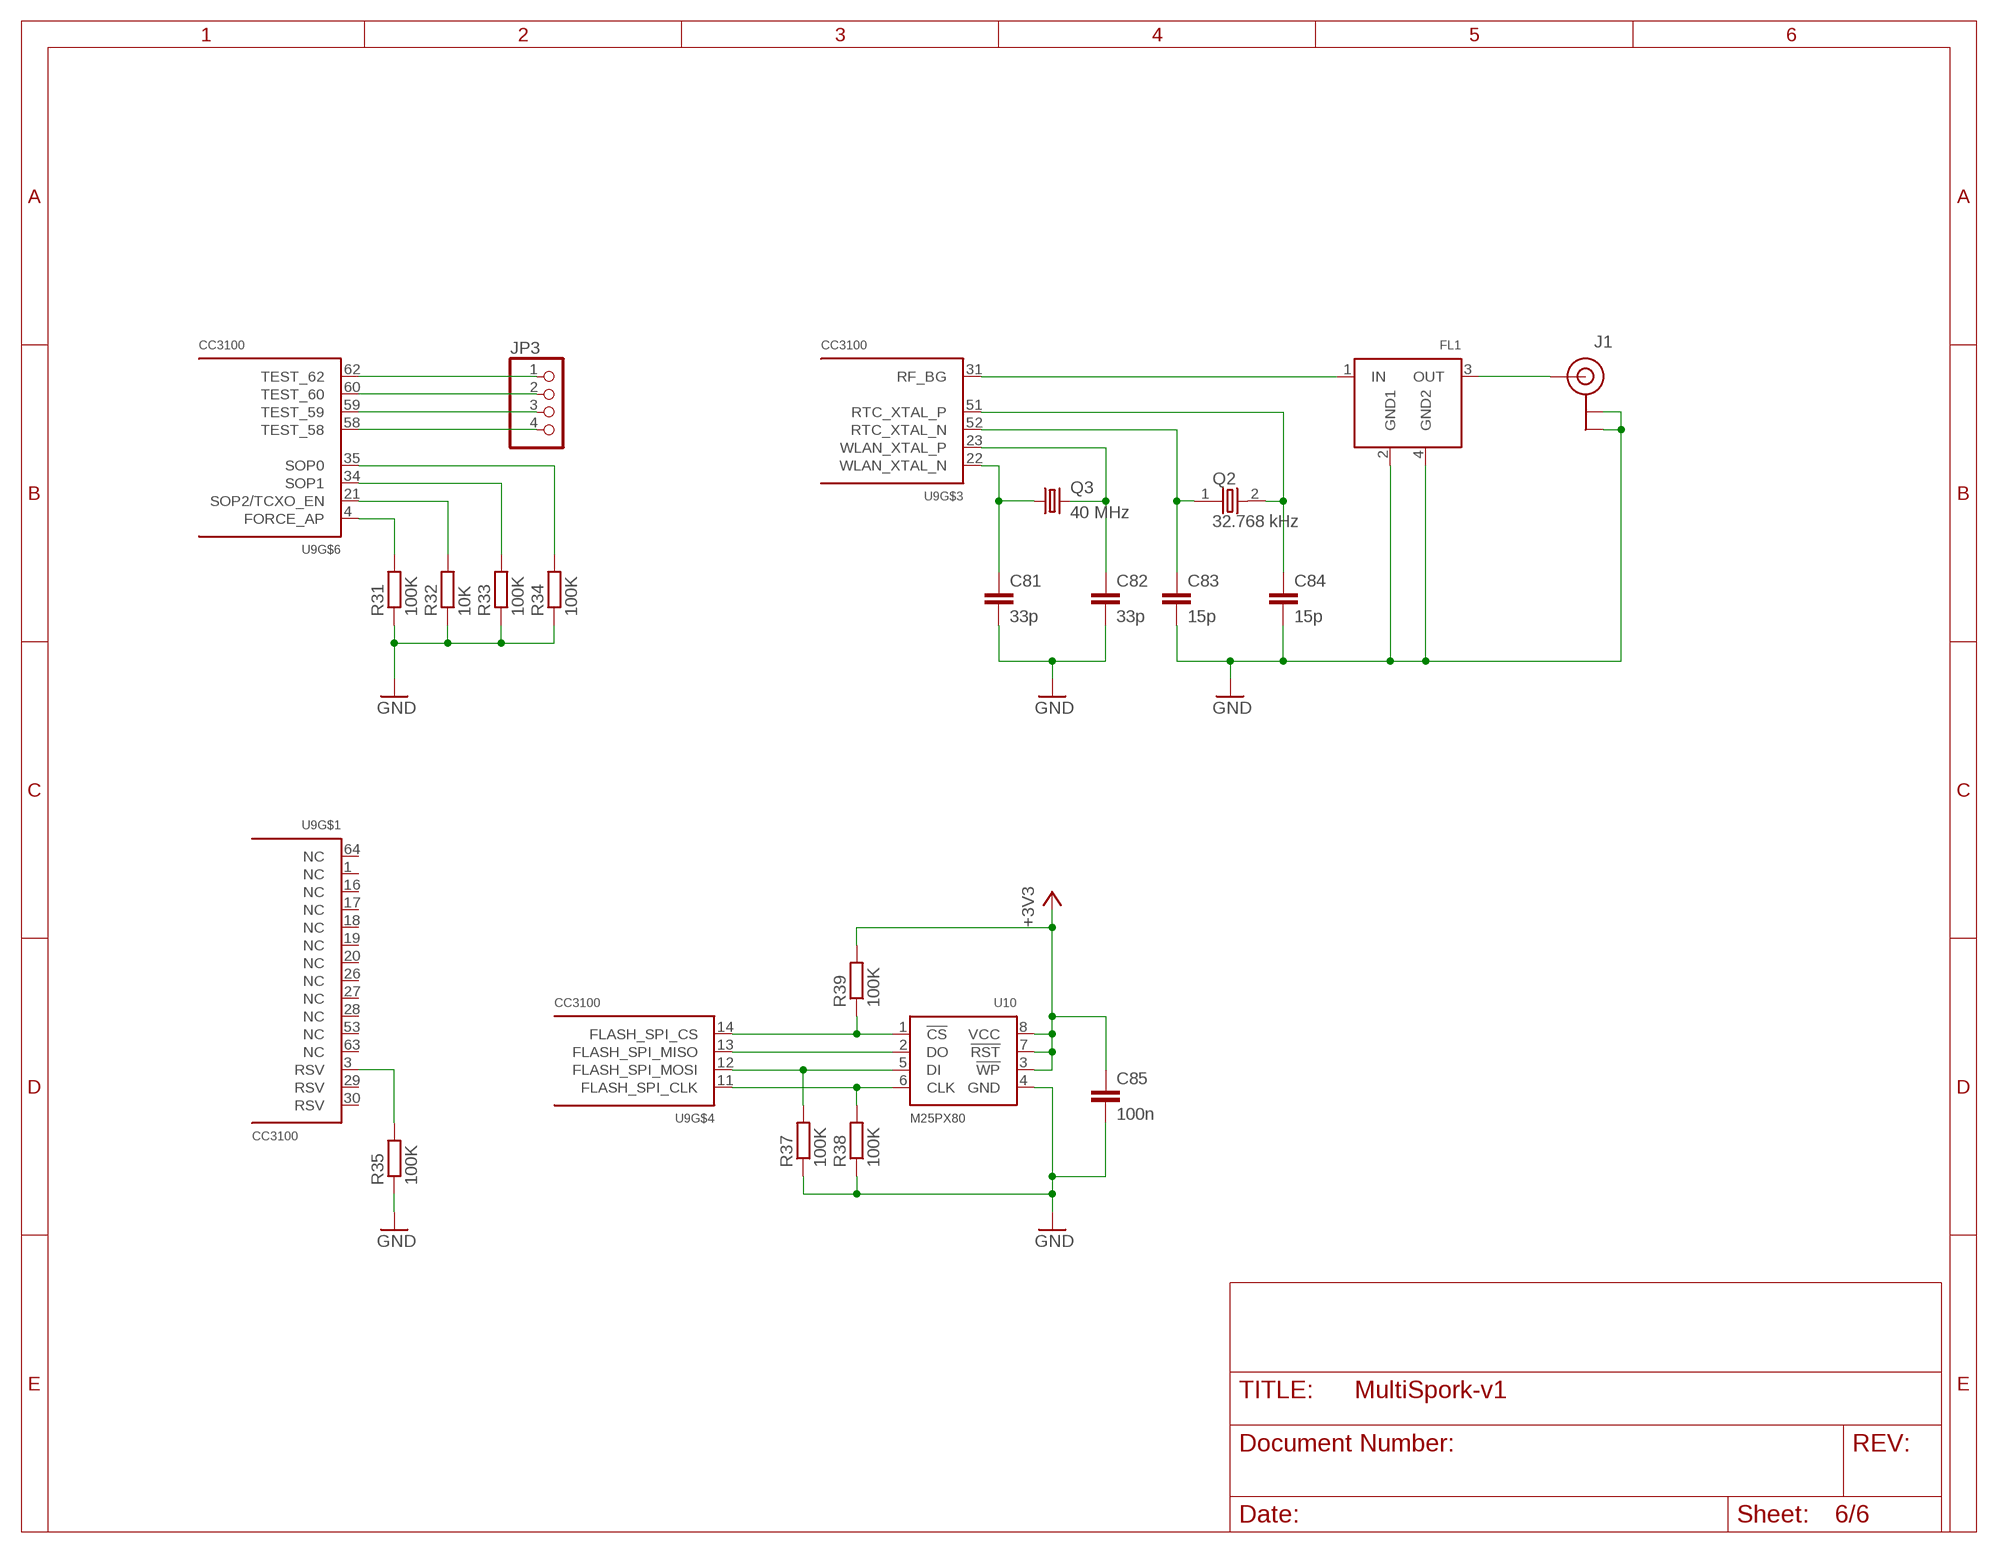
[diagram p5: schematic, sheet 6]

### Parts
C81  33p  C-EUC0603  [C0603]
C82  33p  C-EUC0603  [C0603]
C83  15p  C-EUC0603  [C0603]
C84  15p  C-EUC0603  [C0603]
C85  100n  C-EUC0603  [C0603]
FL1  DEA202450BT  [DEA202450BT]
J1  U.FL  [U.FL]
JP3  PINHD-1X4  [1X04]
Q2  32.768 kHz  ECS-.327-7-34B-TR  [ECX-31B]
Q3  40 MHz  CRYSTALCSM-3X  [CSM-3X]
R31  100K  R-EU_R0603  [R0603]
R32  10K  R-EU_R0603  [R0603]
R33  100K  R-EU_R0603  [R0603]
R34  100K  R-EU_R0603  [R0603]
R35  100K  R-EU_R0603  [R0603]
R37  100K  R-EU_R0603  [R0603]
R38  100K  R-EU_R0603  [R0603]
R39  100K  R-EU_R0603  [R0603]
U10  M25PX80  [SOIC8]

### Nets
+3V3: C85.1 R39.2 U10.3(!WP!) U10.7(!RST!) U10.8(VCC) ; also sheet 1,2,3,5
GND: C81.2 C82.2 C83.2 C84.2 C85.2 FL1.2(GND1) FL1.4(GND2) J1.P$1(GND) J1.P$2(GND) R31.1 R32.1 R33.1 R34.1 R35.1 R37.1 R38.1 U10.4(GND) ; also sheet 1,2,3,5
N$86: R38.2 U9.11(FLASH_SPI_CLK) U10.6(CLK)
N$91: R31.2 U9.4(FORCE_AP)
N$94: R32.2 U9.21(SOP2/TCXO_EN)
N$95: R33.2 U9.34(SOP1)
N$96: R34.2 U9.35(SOP0)
N$97: R37.2 U9.12(FLASH_SPI_MOSI) U10.5(DI)
N$98: JP3.1 U9.62(TEST_62)
N$99: JP3.2 U9.60(TEST_60)
N$100: JP3.3 U9.59(TEST_59)
N$101: JP3.4 U9.58(TEST_58)
N$102: R35.2 U9.3(RSV)
N$103: C81.1 Q3.1 U9.22(WLAN_XTAL_N)
N$104: C82.1 Q3.2 U9.23(WLAN_XTAL_P)
N$105: C83.1 Q2.1 U9.52(RTC_XTAL_N)
N$110: C84.1 Q2.2 U9.51(RTC_XTAL_P)
N$111: U9.13(FLASH_SPI_MISO) U10.2(DO)
N$112: R39.1 U9.14(FLASH_SPI_CS) U10.1(!CS!)
N$113: FL1.1(IN) U9.31(RF_BG)
N$114: FL1.3(OUT) J1.P$3(SIGNAL)
Unconnected: U9.1(NC) U9.16(NC) U9.17(NC) U9.18(NC) U9.19(NC) U9.20(NC) U9.26(NC) U9.27(NC) U9.28(NC) U9.29(RSV) U9.30(RSV) U9.53(NC) U9.63(NC) U9.64(NC)

## Power pins joined to a net without a drawn wire
DCDC_ANA2_SW_N: U9.46(DCDC_ANA2_SW_N)
DCDC_ANA2_SW_P: U9.45(DCDC_ANA2_SW_P)

## Library data of the parts
ACC = pinhead-1:PINHD-2X5: PIN HEADER; PARTNO: *
ANALOG = logos-headers:76385-316LF; PARTNO: 76385-316LF
BAT = SparkFun:M02: Header 2 Standard 2-pin 0.1" header. Use with straight break away headers (SKU : PRT-00116), right angle break away headers (PRT-00553), swiss pins (PRT-00743), machine pins (PRT-00117), and female headers (PRT-00115). Molex polarized connector foot print use with SKU : PRT-08233 with associated crimp pins and housings.; PARTNO: S2B-PH-SM4-TB(LF)(SN)
BAT-TEST = testpad:PTR1: TEST PIN; BOM: EXCLUDE; DNP: T; PARTNO: TP13
C1-C5 C35 C36 C81 C82 = resistor:C-EU: CAPACITOR, European symbol; PARTNO: VJ0603A330JXACW1BC
C6 = resistor:C-EU: CAPACITOR, European symbol; PARTNO: CL10B103KB8NCNC
C7 C8 = resistor:C-EU: CAPACITOR, European symbol; PARTNO: C3216X5R1E106M
C9 C10 C12-C15 C19 C20 C22 C25 C26 C29 C31 C33 C38 C43 C49 C55 C63 C67 C69-C71 C73-C77 C80 C85 = resistor:C-EU: CAPACITOR, European symbol; PARTNO: CC0603KRX7R9BB104
C11 C30 C32 C34 = resistor:C-EU: CAPACITOR, European symbol; PARTNO: UMK107BJ105KA-T
C16 C17 C21 C24 C27 C64-C66 = resistor:C-EU: CAPACITOR, European symbol; PARTNO: GRM188F51A475ZE20D
C18 C68 C72 = resistor:C-EU: CAPACITOR, European symbol; PARTNO: EMK107BBJ106MA-T
C23 = resistor:C-EU: CAPACITOR, European symbol; PARTNO: C1608X7R1A225K
C28 = resistor:C-EU: CAPACITOR, European symbol; PARTNO: C3216Y5V1H475Z; VOLT: 50V
C37 C42 C48 C54 = resistor:C-EU: CAPACITOR, European symbol; PARTNO: TMK325B7475KN-T
C39 C56 = resistor:C-EU: CAPACITOR, European symbol; PARTNO: VJ0603Y222KXACW1BC
C40 C41 C46 C52 C57 C60-C62 = resistor:C-EU: CAPACITOR, European symbol; PARTNO: UMK325BJ106MM
C44 C50 = resistor:C-EU: CAPACITOR, European symbol; PARTNO: UMK107SD102KA-T
C45 C51 C58 = resistor:C-EU: CAPACITOR, European symbol; PARTNO: TMK325B7105KD-T
C47 C53 = resistor:C-EU: CAPACITOR, European symbol; PARTNO: GQM1885C1H220JB01D
C59 = resistor:C-EU: CAPACITOR, European symbol; DNP: T; PARTNO: DNP
C78 C79 = resistor:C-EU: CAPACITOR, European symbol; PARTNO: GRM31CR61C226ME15L
C83 C84 = resistor:C-EU: CAPACITOR, European symbol; PARTNO: VJ0603A150JXACW1BC
C86 C87 = resistor:CPOL-EU: POLARIZED CAPACITOR, European symbol; PARTNO: TAJC107K016RNJ
CHG = led:LED: LED OSRAM: - CHIPLED LG R971, LG N971, LY N971, LG Q971, LY Q971, LO R971, LY R971 LH N974, LH R974 LS Q976, LO Q976, LY Q976 LO Q996 - Hyper CHIPLED LW Q18S LB Q993, LB Q99A, LB R99A - SideLED LS A670, LO A670, LY A670, LG A670, LP A670 LB A673, LV A673, LT A673, LW A673 LH A674 LY A675 LS A676, LA A676, LO A676, LY A676, LW A676 LS A679, LY A679, LG A679 - Hyper Micro SIDELED® LS Y876, LA Y876, LO Y876, LY Y876 LT Y87S - SmartLED LW L88C, LW L88S LB L89C, LB L89S, LG L890 LS L89K, LO L89K, LY L89K LS L896, LA L896, LO L896, LY L896 - TOPLED LS T670, LO T670, LY T670, LG T670, LP T670 LSG T670, LSP T670, LSY T670, LOP T670, LYG T670 LG T671, LOG T671, LSG T671 LB T673, LV T673, LT T673, LW T673 LH T674 LS T676, LA T676, LO T676, LY T676, LB T676, LH T676, LSB T676, LW T676 LB T67C, LV T67C, LT T67C, LS T67K, LO T67K, LY T67K, LW E67C LS E67B, LA E67B, LO E67B, LY E67B, LB E67C, LV E67C, LT E67C LW T67C LS T679, LY T679, LG T679 LS T770, LO T770, LY T770, LG T770, LP T770 LB T773, LV T773, LT T773, LW T773 LH T774 LS E675, LA E675, LY E675, LS T675 LS T776, LA T776, LO T776, LY T776, LB T776 LHGB T686 LT T68C, LB T68C - Hyper Mini TOPLED® LB M676 - Mini TOPLED Santana® LG M470 LS M47K, LO M47K, LY M47K Source: http://www.osram.convergy.de LUXEON: - LUMILED® LXK2-PW12-R00, LXK2-PW12-S00, LXK2-PW14-U00, LXK2-PW14-V00 LXK2-PM12-R00, LXK2-PM12-S00, LXK2-PM14-U00 LXK2-PE12-Q00, LXK2-PE12-R00, LXK2-PE12-S00, LXK2-PE14-T00, LXK2-PE14-U00 LXK2-PB12-K00, LXK2-PB12-L00, LXK2-PB12-M00, LXK2-PB14-N00, LXK2-PB14-P00, LXK2-PB14-Q00 LXK2-PR12-L00, LXK2-PR12-M00, LXK2-PR14-Q00, LXK2-PR14-R00 LXK2-PD12-Q00, LXK2-PD12-R00, LXK2-PD12-S00 LXK2-PH12-R00, LXK2-PH12-S00 LXK2-PL12-P00, LXK2-PL12-Q00, LXK2-PL12-R00 Source: www.luxeon.com KINGBRIGHT: KA-3528ASYC Source: www.kingbright.com; PARTNO: LTST-C193KRKT-5A
D1-D13 = logos-diodes:SD103ASDM: Digikey SD103ASDM-FDICT-ND; PARTNO: SD103ASDM-7
D14 D15 = diode:DIODE-: DIODE; PARTNO: LSM115JE3
D16 D18 D19 = adafruit:DIODE: Diode SMADIODE - SMA Surface Mount Package 20V 1A Schottky Diode Digikey: 641-1014-6-ND DO-1N4148 - Through Hole Small Current Diode SOD-123 20V 1 A (.5mV Vf) Schottky Diode - Digikey: MBRX120TPMSCT-ND SOD-323 10V 570mA (.38mV Vf, 3ns) Schottky Diode - Digikey: ZLLS410CT-ND SOD-523 30V 30mA Schottky Diode (RB751S-40TE61) - Digikey: RB751S-40TE61CT-ND SOT23-R/W - SOT23 Package (R = Solder Paste/Reflow Ovens, W = Hand-Soldering) BAT54Film 40V 300mA - Digikey: 497-7162-1-ND; PARTNO: CD214A-B240LLF
D17 = adafruit:DIODE: Diode SMADIODE - SMA Surface Mount Package 20V 1A Schottky Diode Digikey: 641-1014-6-ND DO-1N4148 - Through Hole Small Current Diode SOD-123 20V 1 A (.5mV Vf) Schottky Diode - Digikey: MBRX120TPMSCT-ND SOD-323 10V 570mA (.38mV Vf, 3ns) Schottky Diode - Digikey: ZLLS410CT-ND SOD-523 30V 30mA Schottky Diode (RB751S-40TE61) - Digikey: RB751S-40TE61CT-ND SOT23-R/W - SOT23 Package (R = Solder Paste/Reflow Ovens, W = Hand-Soldering) BAT54Film 40V 300mA - Digikey: 497-7162-1-ND; PARTNO: PMEG3020ER,115
ERASE = SparkFun-Passives:JUMPER-PAD-2-NO; BOM: EXCLUDE
F1 = adafruit:PTCFUSE: PTC fuses, resettable thermistors; PARTNO: 1206L050/15YR
F2 = adafruit:PTCFUSE: PTC fuses, resettable thermistors; PARTNO: 0ZCJ0100FF2E
F3-F22 = SparkFun-PowerIC:PTC: Resettable Fuse PTC Resettable Fuse. Spark Fun Electronics SKU : COM-08357; PARTNO: femtoSMDC008F-02
FL1 = CC3100:DEA202450BT; PARTNO: DEA202450BT-7210A1
H1-H4 = holes:MOUNT-PAD-ROUND: MOUNTING PAD, round; BOM: EXCLUDE; PARTNO: *
J1 = SparkFun-Connectors:U.FL: SMD antenna connector- WRL-09144; PARTNO: U.FL-R-SMT(10); PROD_ID: CONN-09193
JP1 = MultiSpork-parts:PINHEAD_PINHD-2X5: PIN HEADER; PARTNO: M50-3500542
JP2 = pinhead:PINHD-1X6: PIN HEADER; PARTNO: *
JP3 = pinhead:PINHD-1X4: PIN HEADER; PARTNO: *
JTAG_RST JTAGSEL TST = SparkFun-Passives:JUMPER-PAD-2-NC_BY_TRACE; BOM: EXCLUDE
L1 = SparkFun-Passives:INDUCTOR: Inductors Basic Inductor/Choke - 0603 and 1206. Footprints are not proven and vary greatly between part numbers. SRN6045- 33uH, 20% 1.4A SDR0403-560KL - 56uH, 10%, 500mA RMS/740mA peak; PARTNO: MI0805K400R-10
L2 = SparkFun-Passives:INDUCTOR: Inductors Basic Inductor/Choke - 0603 and 1206. Footprints are not proven and vary greatly between part numbers. SRN6045- 33uH, 20% 1.4A SDR0403-560KL - 56uH, 10%, 500mA RMS/740mA peak; PARTNO: LQH31CN100K03L
L3 = logos-inductors:L-US; PARTNO: SRR5018-3R9Y
L4-L7 = logos-inductors:L-US; PARTNO: 252012CDMCDS-2R2MC
L8 = logos-inductors:L-US; PARTNO: SRR5028-5R3Y
L9 = logos-inductors:L-US; PARTNO: 1008 (2520 metric)
L10 L12 = SparkFun-Passives:INDUCTOR: Inductors Basic Inductor/Choke - 0603 and 1206. Footprints are not proven and vary greatly between part numbers. SRN6045- 33uH, 20% 1.4A SDR0403-560KL - 56uH, 10%, 500mA RMS/740mA peak; PARTNO: LQM31PN2R2M00L
L11 = SparkFun-Passives:INDUCTOR: Inductors Basic Inductor/Choke - 0603 and 1206. Footprints are not proven and vary greatly between part numbers. SRN6045- 33uH, 20% 1.4A SDR0403-560KL - 56uH, 10%, 500mA RMS/740mA peak; PARTNO: LQM31PN1R0MC0L
Q1 = logos-crystals:CRYSTAL: CRYSTAL; PARTNO: ECS-200-20-3X-TR
Q2 = logos-crystals:ECS-.327-7-34B-TR: CRYSTAL 32.768 KHZ 7PF SMD; PARTNO: ECS-.327-7-34B-TR
Q3 = logos-crystals:CRYSTAL: CRYSTAL; PARTNO: ECS-400-20-3X-EN-TR
Q4 Q5 = SparkFun-DiscreteSemi:TRANSISTOR_NPN: Generic NPN BJT MMBT2222A - TRANS-08049 (SOT-23, 1A 40V) MPSA42 - TRANS-09116 (SOT-23, 500mA 300V) MMBT5088LT1G - TRANS-11160 (SOT-23, 50 mA 30V) BC547 - COM-08928 <http://www.sparkfun.com/products/8928> (TO-92 45V 100mA) (1.Collector 2.Base 3.Emitter) 2N3904 - COM-00521 <http://www.sparkfun.com/products/521> (TO-92 40V 200mA) (1.Emitter 2.Base 3.Collector) P2N2222A - COM-12852 <http://www.sparkfun.com/products/12852> (TO-92 40V 600mA) (1.Collector 2.Base 3.Emitter); PARTNO: MMBT3904; PROD_ID: TRANS-11160; VALUE: MMBT5088
R1 R16 R19 R22 = resistor:R-EU_: RESISTOR, European symbol; PARTNO: MCT06030C4702FP500
R2 R6 R7 = res-cap-arrays:4R-N: Array Chip Resistor Source: RS Component / Phycomp; PARTNO: 742C083101JPTR
R3 R4 = resistor:R-EU_: RESISTOR, European symbol; PARTNO: CRCW060327R0FKEA
R5 = resistor:R-EU_: RESISTOR, European symbol; PARTNO: ERJ-3GEYJ152V
R8 = resistor:R-EU_: RESISTOR, European symbol; PARTNO: ERJ-3GEYJ1R0V
R9 R15 R18 R21 R24 R25 R32 R36 = resistor:R-EU_: RESISTOR, European symbol; PARTNO: RNCP0603FTD10K0
R10 = resistor:R-EU_: RESISTOR, European symbol; PARTNO: RC0603FR-072KL
R11 = resistor:R-EU_: RESISTOR, European symbol; PARTNO: RMCF0603FT1K00
R12 = resistor:R-EU_: RESISTOR, European symbol; BOM: INCLUDE; PARTNO: ERJ-3EKF1204V
R13 = resistor:R-EU_: RESISTOR, European symbol; BOM: INCLUDE; PARTNO: ERJ-3EKF1004V
R14 = resistor:R-EU_: RESISTOR, European symbol; PARTNO: CRCW0603105KFKEA
R17 = resistor:R-EU_: RESISTOR, European symbol; PARTNO: CRCW060345K3FKEA
R20 = resistor:R-EU_: RESISTOR, European symbol; PARTNO: CRCW060324K0FKEA
R23 = resistor:R-EU_: RESISTOR, European symbol; PARTNO: AF0603FR-07120KL
R26-R28 R31 R33-R35 R37-R39 = resistor:R-EU_: RESISTOR, European symbol; PARTNO: CRCW0603100KFKEA
R29 R30 = resistor:R-EU_: RESISTOR, European symbol; PARTNO: RC1608J472CS
R40 = resistor:R-EU_: RESISTOR, European symbol; PARTNO: CRCW12061R00FKEA
RESET = switch:SKHMP*E010: 6.2 X 6.5mm TACT Switch (SMD) Source: http://www3.alps.co.jp/WebObjects/catalog.woa/PDF/E/Switch/Tact/SKHM/SKHM.PDF; PARTNO: SKHMQKE010
SW1 = logos-switch:JS102011SAQN: SPDT SMT right angle slide switch; PARTNO: JS102011SAQN
U1 = logos-headers:USD-SOCKET: microSD Socket Push-push type uSD socket. Schematic element and footprint production proven. Spark Fun Electronics SKU : PRT-00127. tDoc lines correctly indicate media card edge positions when inserting (unlocked, locked, depressed).; PARTNO: 502570-0893
U2 = atmel-sam3s:SAM3S*A; PARTNO: ATSAM3S4AA-MU
U3 = MAX11300:MAX11300GTL; PARTNO: MAX11300GTL+
U4-U6 U8 = MultiSpork-parts:LT3580; PARTNO: LT3580EMS8E#PBF
U7 = SparkFun:MCP73831: Microchip's MCP73831 Miniature single cell, fully integrated Li-Ion, Li-polymer charge management controller http://ww1.microchip.com/downloads/en/DeviceDoc/21984a.pdf; PARTNO: MCP73831T-2ACI/OT
U9 = CC3100:CC3100; PARTNO: CC3100
U10 = CC3100:M25PX80; PARTNO: M25PX80-VMN6TP
USB-IN = adafruit:USB: USB Connectors USBMINIB - Surface Mount Female Mini-B USB Connector 4UConnector: 06564 By microbuilder.eu Thru-hole RA Female Mini-B USB Connector 4UConnector: 18732 By ladyada.net; PARTNO: 20236

## Net classes
2 gnd: width 0.152 mm
3 usbvcc: width 0.152 mm